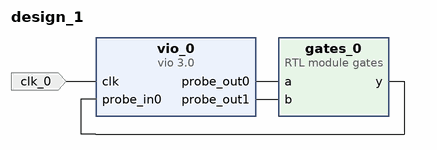
[diagram p0: block diagram of the top level]
# Vivado block design design_1, xc7a35tftg256-1, Vivado 2024.2
create_bd_design design_1

create_bd_port -dir I -type clk clk_0

create_bd_cell -type module -reference gates gates_0
create_bd_cell -type ip -vlnv xilinx.com:ip:vio:3.0 vio_0
set_property -dict {CONFIG.C_NUM_PROBE_IN 1 CONFIG.C_NUM_PROBE_OUT 2} [get_bd_cells vio_0]

# ---- connections ----

connect_bd_net -net clk_0_1 [get_bd_ports clk_0] [get_bd_pins vio_0/clk]
connect_bd_net [get_bd_pins gates_0/y] [get_bd_pins vio_0/probe_in0]
connect_bd_net [get_bd_pins vio_0/probe_out0] [get_bd_pins gates_0/a]
connect_bd_net [get_bd_pins vio_0/probe_out1] [get_bd_pins gates_0/b]

validate_bd_design
save_bd_design
